# EAGLE schematic SpiderSensy_Circuitry (EAGLE 9.5.1)
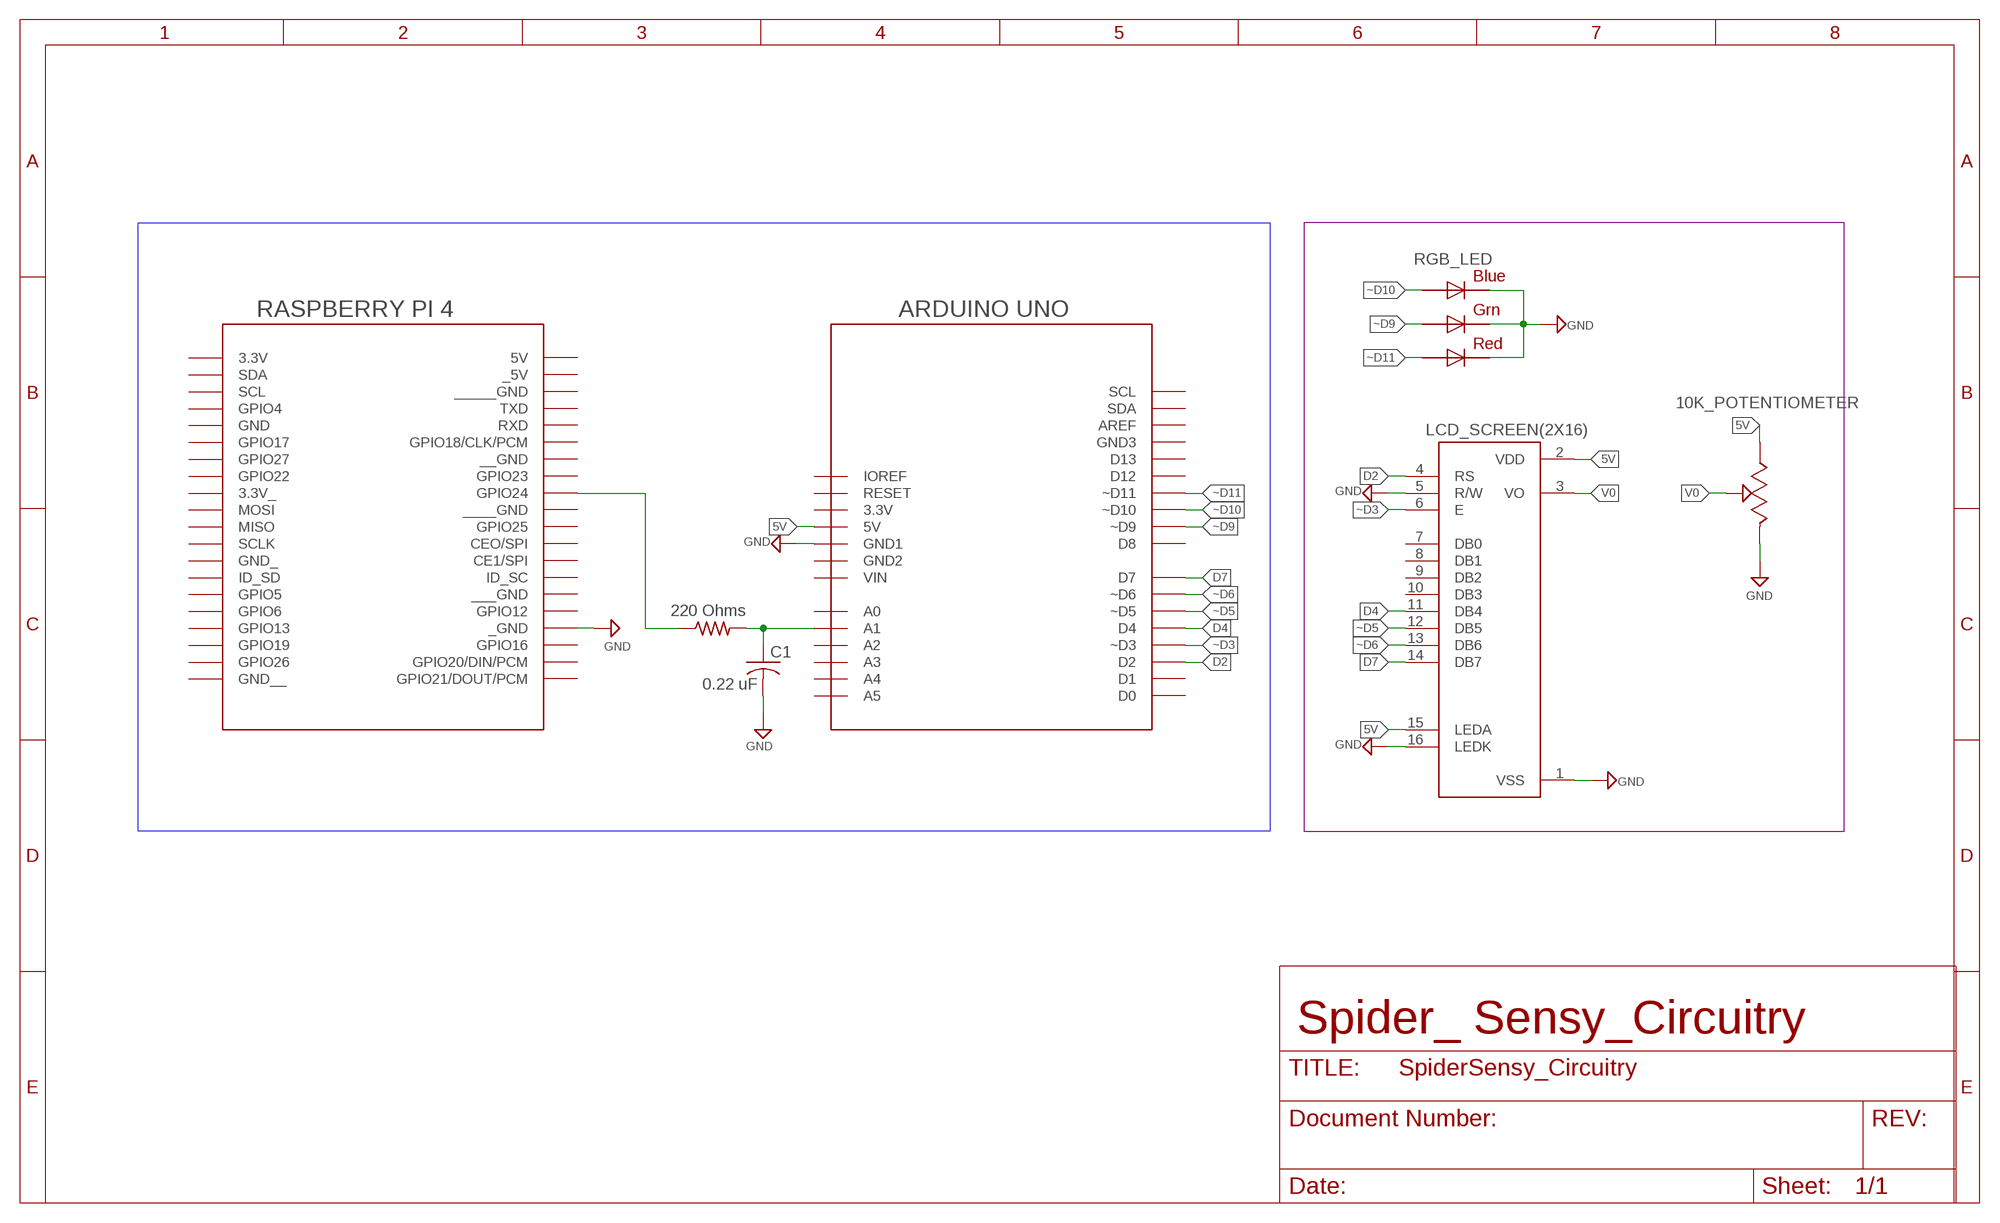
[diagram p0: schematic, sheet 1]

## Parts
10K_POTENTIOMETER  3312J-1-103E  [TRIMMER_3312J-1-103E]
C1  0.22 uF  C-US025-024X044  [C025-024X044]
LCD_SCREEN(2X16)  LCD2X16_16026_16X2_BYG_5V  [LCD_LCD2X16]
R1  220 Ohms  R-US_R0805  [R0805]
RGB_LED  RGBLED5050  [RGBLED5050]
U$1  ARDUINO_UNO  [ARDUINO_UNO]
U$3  RASPBERRYPI  [RASPBERRY_PI]

## Nets
5V: 10K_POTENTIOMETER.1(CCW) LCD_SCREEN(2X16).2(VDD) LCD_SCREEN(2X16).15(LEDA) U$1.P$2(5V)
D2: LCD_SCREEN(2X16).4(RS) U$1.P$12(D2)
D4: LCD_SCREEN(2X16).11(DB4) U$1.P$13(D4)
D7: LCD_SCREEN(2X16).14(DB7) U$1.P$14(D7)
GND: 10K_POTENTIOMETER.3(CW) C1.2 LCD_SCREEN(2X16).1(VSS) LCD_SCREEN(2X16).5(R/W) LCD_SCREEN(2X16).16(LEDK) RGB_LED.4(BLUE_C) RGB_LED.5(RED_C) RGB_LED.6(GREEN_C) U$1.P$18(GND1) U$3.P$36(_GND)
N$33: R1.1 U$3.P$24(GPIO24)
N$41: C1.1 R1.2 U$1.P$4(A1)
V0: 10K_POTENTIOMETER.2(WIPER) LCD_SCREEN(2X16).3(VO)
~D3: LCD_SCREEN(2X16).6(E) U$1.P$26(~D3)
~D5: LCD_SCREEN(2X16).12(DB5) U$1.P$27(~D5)
~D6: LCD_SCREEN(2X16).13(DB6) U$1.P$28(~D6)
~D9: RGB_LED.1(GREEN_A) U$1.P$29(~D9)
~D10: RGB_LED.3(BLUE_A) U$1.P$30(~D10)
~D11: RGB_LED.2(RED_A) U$1.P$31(~D11)
Unconnected: LCD_SCREEN(2X16).7(DB0) LCD_SCREEN(2X16).8(DB1) LCD_SCREEN(2X16).9(DB2) LCD_SCREEN(2X16).10(DB3) U$1.P$1(3.3V) U$1.P$3(A0) U$1.P$5(A2) U$1.P$6(A3) U$1.P$7(A4) U$1.P$8(A5) U$1.P$9(AREF) U$1.P$10(D0) U$1.P$11(D1) U$1.P$15(D8) U$1.P$16(D12) U$1.P$17(D13) U$1.P$19(GND2) U$1.P$20(GND3) U$1.P$21(IOREF) U$1.P$22(RESET) U$1.P$23(SCL) U$1.P$24(SDA) U$1.P$25(VIN) U$3.P$1(3.3V) U$3.P$2(3.3V_) U$3.P$3(5V) U$3.P$4(_5V) U$3.P$5(CE1/SPI) U$3.P$6(CEO/SPI) U$3.P$7(GND) U$3.P$8(GND_) U$3.P$9(GND__) U$3.P$10(GPIO4) U$3.P$11(GPIO5) U$3.P$12(GPIO6) U$3.P$13(GPIO12) U$3.P$14(GPIO13) U$3.P$15(GPIO16) U$3.P$16(GPIO17) U$3.P$17(GPIO19) U$3.P$18(GPIO18/CLK/PCM) U$3.P$19(GPIO26) U$3.P$20(GPIO20/DIN/PCM) U$3.P$21(GPIO21/DOUT/PCM) U$3.P$22(GPIO22) U$3.P$23(GPIO23) U$3.P$25(GPIO25) U$3.P$26(GPIO27) U$3.P$27(ID_SC) U$3.P$28(ID_SD) U$3.P$29(MISO) U$3.P$30(MOSI) U$3.P$31(RXD) U$3.P$32(SCL) U$3.P$33(SCLK) U$3.P$34(SDA) U$3.P$35(TXD) U$3.P$37(__GND) U$3.P$38(___GND) U$3.P$39(____GND) U$3.P$40(_____GND)

## Notes on the sheet
- Spider_ Sensy_Circuitry

## Library data of the parts
10K_POTENTIOMETER = 3312J-1-103E:3312J-1-103E: Res Cermet Trimmer 500K Ohm 20% 1/10W 1(Elec)/1(Mech)Turn (2.5 X 2.8 X 1.7mm) J-Hook SMD Embossed T/R Check prices <https://pricing.snapeda.com/parts/3312J-1-103E/Bourns/view-part?ref=eda>; AVAILABILITY: Good; DESCRIPTION: 10 kOhms 0.1W, 1/10W J Lead Surface Mount Trimmer Potentiometer Cermet 1 Turn Top Adjustment; MF: Bourns; MP: 3312J-1-103E; PACKAGE: Bourns; PRICE: None; PURCHASE-URL: https://pricing.snapeda.com/search/part/3312J-1-103E/?ref=eda
C1 = adafruit:C-US: CAPACITOR, American symbol
LCD_SCREEN(2X16) = LCD2X16:LCD2X16: Display; Display: LCD 2x16 characters (blue backlight); AVAILABILITY: Unavailable; DESCRIPTION: Display; Display: LCD 2x16 characters (blue backlight); MF: mikroElektronika; MP: LCD2X16; PACKAGE: None; PRICE: None
R1 = adafruit:R-US_: RESISTOR, American symbol
RGB_LED = adafruit:RGBLED: For 5050 RGB LEDs, the order of the LEDs may vary from one manufacturer to another!
U$1 = RaspberryPi:ARDUINO_UNO
U$3 = RaspberryPi:RASPBERRYPI